# EAGLE design W108C (EAGLE 6.6.0)
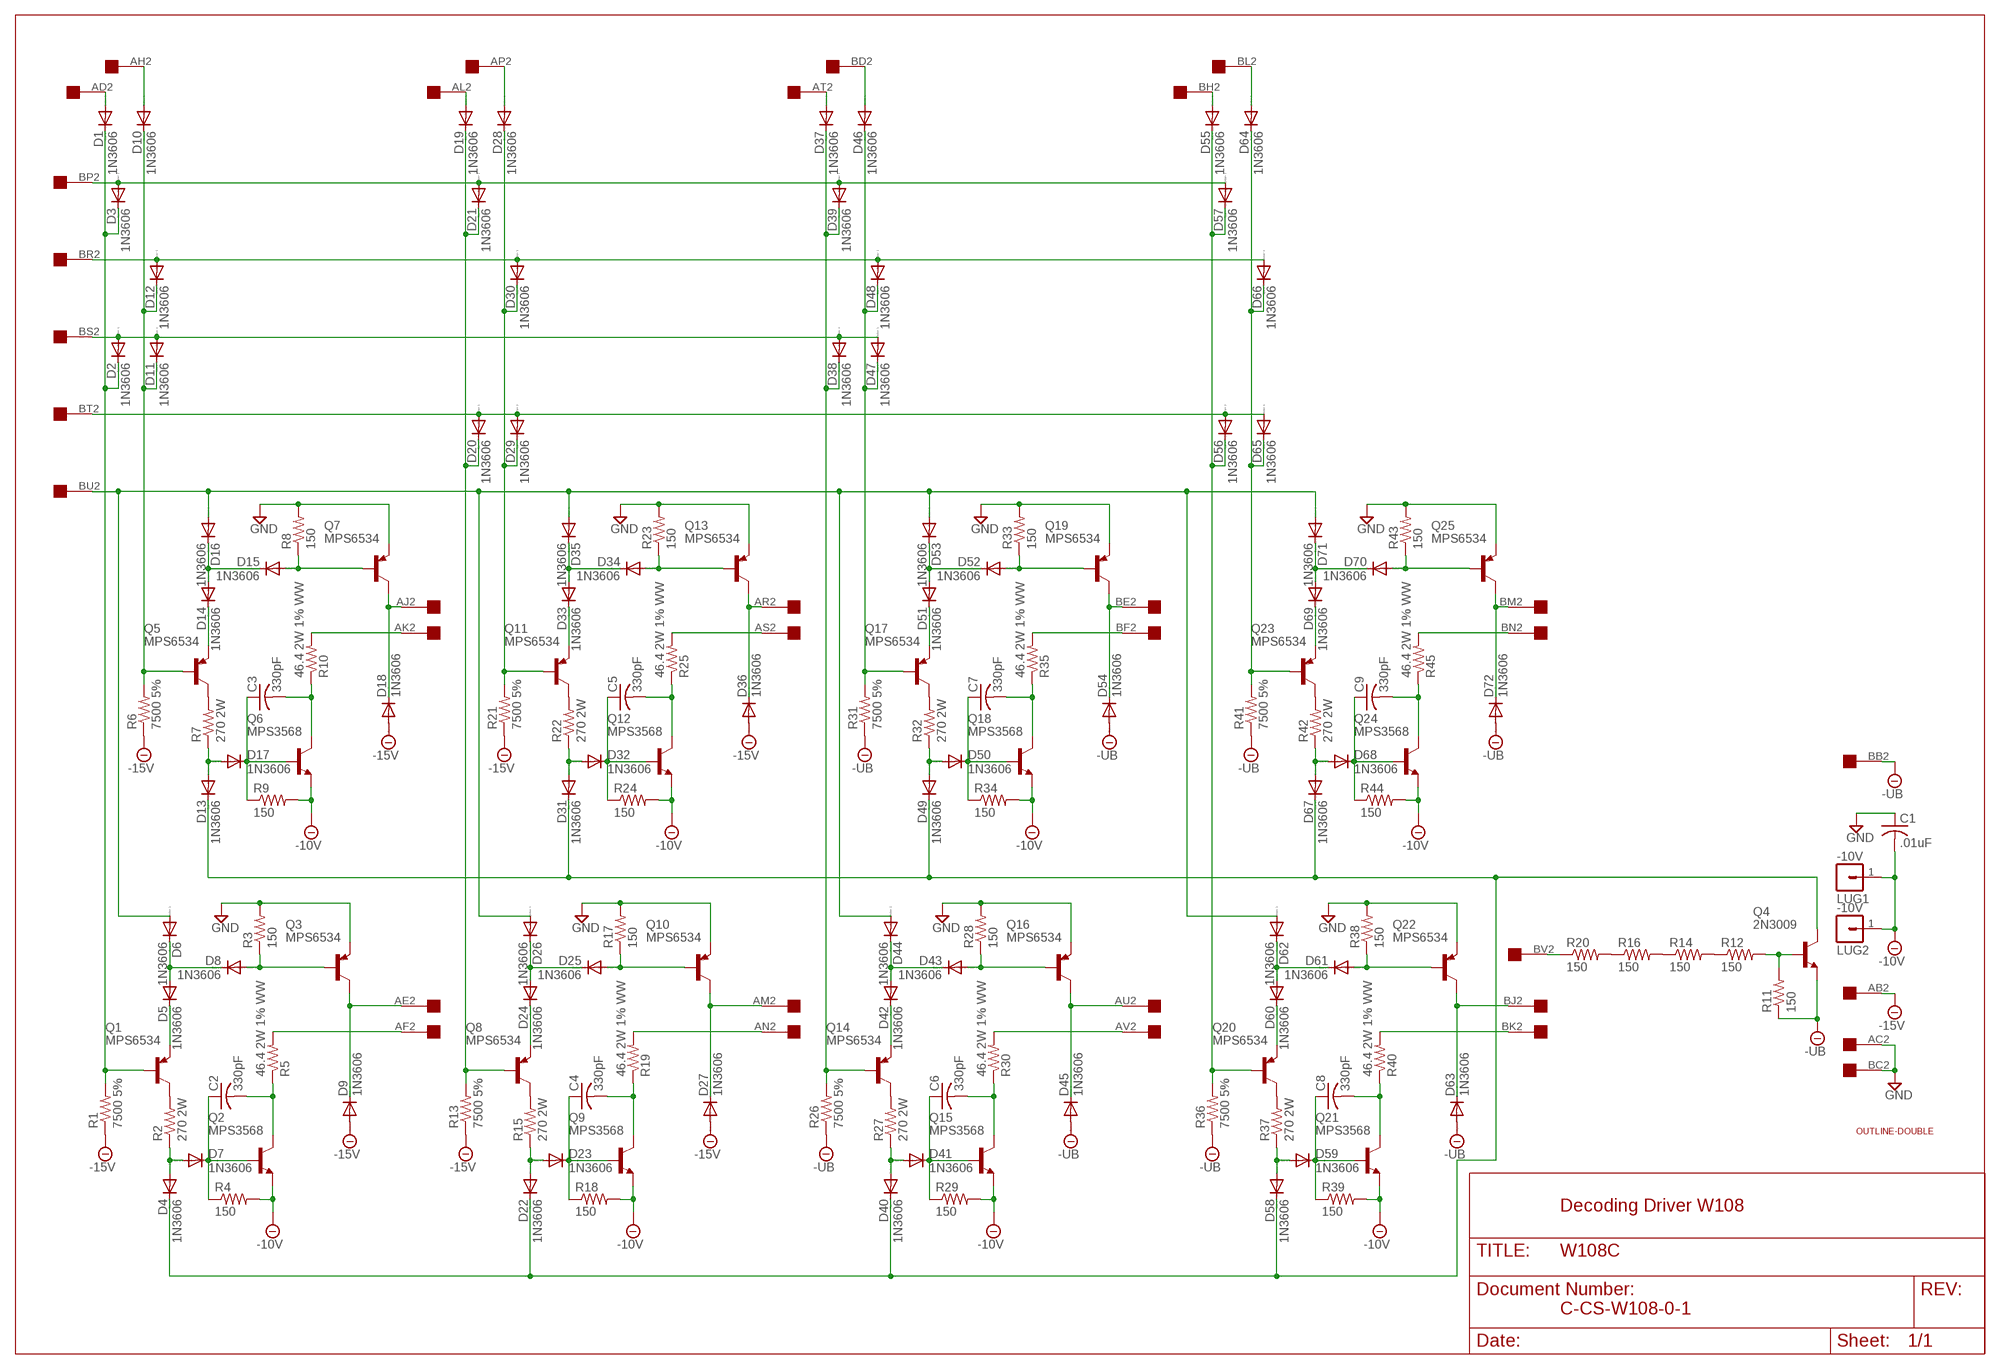
[diagram p0: schematic, sheet 1]

## Parts
C1  .01uF  C-US075-032X103  [C075-032X103]
C2  330pF  C-US075-032X103  [C075-032X103]
C3  330pF  C-US075-032X103  [C075-032X103]
C4  330pF  C-US075-032X103  [C075-032X103]
C5  330pF  C-US075-032X103  [C075-032X103]
C6  330pF  C-US075-032X103  [C075-032X103]
C7  330pF  C-US075-032X103  [C075-032X103]
C8  330pF  C-US075-032X103  [C075-032X103]
C9  330pF  C-US075-032X103  [C075-032X103]
D1  1N3606  1N4148DO35-10  [DO35-10]
D2  1N3606  1N4148DO35-10  [DO35-10]
D3  1N3606  1N4148DO35-10  [DO35-10]
D4  1N3606  1N4148DO35-10  [DO35-10]
D5  1N3606  1N4148DO35-10  [DO35-10]
D6  1N3606  1N4148DO35-10  [DO35-10]
D7  1N3606  1N4148DO35-10  [DO35-10]
D8  1N3606  1N4148DO35-10  [DO35-10]
D9  1N3606  1N4148DO35-10  [DO35-10]
D10  1N3606  1N4148DO35-10  [DO35-10]
D11  1N3606  1N4148DO35-10  [DO35-10]
D12  1N3606  1N4148DO35-10  [DO35-10]
D13  1N3606  1N4148DO35-10  [DO35-10]
D14  1N3606  1N4148DO35-10  [DO35-10]
D15  1N3606  1N4148DO35-10  [DO35-10]
D16  1N3606  1N4148DO35-10  [DO35-10]
D17  1N3606  1N4148DO35-10  [DO35-10]
D18  1N3606  1N4148DO35-10  [DO35-10]
D19  1N3606  1N4148DO35-10  [DO35-10]
D20  1N3606  1N4148DO35-10  [DO35-10]
D21  1N3606  1N4148DO35-10  [DO35-10]
D22  1N3606  1N4148DO35-10  [DO35-10]
D23  1N3606  1N4148DO35-10  [DO35-10]
D24  1N3606  1N4148DO35-10  [DO35-10]
D25  1N3606  1N4148DO35-10  [DO35-10]
D26  1N3606  1N4148DO35-10  [DO35-10]
D27  1N3606  1N4148DO35-10  [DO35-10]
D28  1N3606  1N4148DO35-10  [DO35-10]
D29  1N3606  1N4148DO35-10  [DO35-10]
D30  1N3606  1N4148DO35-10  [DO35-10]
D31  1N3606  1N4148DO35-10  [DO35-10]
D32  1N3606  1N4148DO35-10  [DO35-10]
D33  1N3606  1N4148DO35-10  [DO35-10]
D34  1N3606  1N4148DO35-10  [DO35-10]
D35  1N3606  1N4148DO35-10  [DO35-10]
D36  1N3606  1N4148DO35-10  [DO35-10]
D37  1N3606  1N4148DO35-10  [DO35-10]
D38  1N3606  1N4148DO35-10  [DO35-10]
D39  1N3606  1N4148DO35-10  [DO35-10]
D40  1N3606  1N4148DO35-10  [DO35-10]
D41  1N3606  1N4148DO35-10  [DO35-10]
D42  1N3606  1N4148DO35-10  [DO35-10]
D43  1N3606  1N4148DO35-10  [DO35-10]
D44  1N3606  1N4148DO35-10  [DO35-10]
D45  1N3606  1N4148DO35-10  [DO35-10]
D46  1N3606  1N4148DO35-10  [DO35-10]
D47  1N3606  1N4148DO35-10  [DO35-10]
D48  1N3606  1N4148DO35-10  [DO35-10]
D49  1N3606  1N4148DO35-10  [DO35-10]
D50  1N3606  1N4148DO35-10  [DO35-10]
D51  1N3606  1N4148DO35-10  [DO35-10]
D52  1N3606  1N4148DO35-10  [DO35-10]
D53  1N3606  1N4148DO35-10  [DO35-10]
D54  1N3606  1N4148DO35-10  [DO35-10]
D55  1N3606  1N4148DO35-10  [DO35-10]
D56  1N3606  1N4148DO35-10  [DO35-10]
D57  1N3606  1N4148DO35-10  [DO35-10]
D58  1N3606  1N4148DO35-10  [DO35-10]
D59  1N3606  1N4148DO35-10  [DO35-10]
D60  1N3606  1N4148DO35-10  [DO35-10]
D61  1N3606  1N4148DO35-10  [DO35-10]
D62  1N3606  1N4148DO35-10  [DO35-10]
D63  1N3606  1N4148DO35-10  [DO35-10]
D64  1N3606  1N4148DO35-10  [DO35-10]
D65  1N3606  1N4148DO35-10  [DO35-10]
D66  1N3606  1N4148DO35-10  [DO35-10]
D67  1N3606  1N4148DO35-10  [DO35-10]
D68  1N3606  1N4148DO35-10  [DO35-10]
D69  1N3606  1N4148DO35-10  [DO35-10]
D70  1N3606  1N4148DO35-10  [DO35-10]
D71  1N3606  1N4148DO35-10  [DO35-10]
D72  1N3606  1N4148DO35-10  [DO35-10]
LUG1  -10V  LUG  [SPADELUG]
LUG2  -10V  LUG  [SPADELUG]
Q1  MPS6534  2N2904  [TO39]
Q2  MPS3568  2N2102  [TO5]
Q3  MPS6534  2N2904  [TO39]
Q4  2N3009  2N2102  [TO5]
Q5  MPS6534  2N2904  [TO39]
Q6  MPS3568  2N2102  [TO5]
Q7  MPS6534  2N2904  [TO39]
Q8  MPS6534  2N2904  [TO39]
Q9  MPS3568  2N2102  [TO5]
Q10  MPS6534  2N2904  [TO39]
Q11  MPS6534  2N2904  [TO39]
Q12  MPS3568  2N2102  [TO5]
Q13  MPS6534  2N2904  [TO39]
Q14  MPS6534  2N2904  [TO39]
Q15  MPS3568  2N2102  [TO5]
Q16  MPS6534  2N2904  [TO39]
Q17  MPS6534  2N2904  [TO39]
Q18  MPS3568  2N2102  [TO5]
Q19  MPS6534  2N2904  [TO39]
Q20  MPS6534  2N2904  [TO39]
Q21  MPS3568  2N2102  [TO5]
Q22  MPS6534  2N2904  [TO39]
Q23  MPS6534  2N2904  [TO39]
Q24  MPS3568  2N2102  [TO5]
Q25  MPS6534  2N2904  [TO39]
R1  7500 5%  R-US_0207/10  [0207/10]
R2  270 2W  R-US_0617/22  [0617/22]
R3  150  R-US_0207/10  [0207/10]
R4  150  R-US_0207/10  [0207/10]
R5  46.4 2W 1% WW  R-US_0414/20  [0414/20]
R6  7500 5%  R-US_0207/10  [0207/10]
R7  270 2W  R-US_0617/22  [0617/22]
R8  150  R-US_0207/10  [0207/10]
R9  150  R-US_0207/10  [0207/10]
R10  46.4 2W 1% WW  R-US_0414/20  [0414/20]
R11  150  R-US_0207/10  [0207/10]
R12  150  R-US_0207/10  [0207/10]
R13  7500 5%  R-US_0207/10  [0207/10]
R14  150  R-US_0207/10  [0207/10]
R15  270 2W  R-US_0617/22  [0617/22]
R16  150  R-US_0207/10  [0207/10]
R17  150  R-US_0207/10  [0207/10]
R18  150  R-US_0207/10  [0207/10]
R19  46.4 2W 1% WW  R-US_0414/20  [0414/20]
R20  150  R-US_0207/10  [0207/10]
R21  7500 5%  R-US_0207/10  [0207/10]
R22  270 2W  R-US_0617/22  [0617/22]
R23  150  R-US_0207/10  [0207/10]
R24  150  R-US_0207/10  [0207/10]
R25  46.4 2W 1% WW  R-US_0414/20  [0414/20]
R26  7500 5%  R-US_0207/10  [0207/10]
R27  270 2W  R-US_0617/22  [0617/22]
R28  150  R-US_0207/10  [0207/10]
R29  150  R-US_0207/10  [0207/10]
R30  46.4 2W 1% WW  R-US_0414/20  [0414/20]
R31  7500 5%  R-US_0207/10  [0207/10]
R32  270 2W  R-US_0617/22  [0617/22]
R33  150  R-US_0207/10  [0207/10]
R34  150  R-US_0207/10  [0207/10]
R35  46.4 2W 1% WW  R-US_0414/20  [0414/20]
R36  7500 5%  R-US_0207/10  [0207/10]
R37  270 2W  R-US_0617/22  [0617/22]
R38  150  R-US_0207/10  [0207/10]
R39  150  R-US_0207/10  [0207/10]
R40  46.4 2W 1% WW  R-US_0414/20  [0414/20]
R41  7500 5%  R-US_0207/10  [0207/10]
R42  270 2W  R-US_0617/22  [0617/22]
R43  150  R-US_0207/10  [0207/10]
R44  150  R-US_0207/10  [0207/10]
R45  46.4 2W 1% WW  R-US_0414/20  [0414/20]
U$1  OUTLINE-DOUBLE  [DOUBLE]
U$2  DOUBLE  [EDGE-CON4]

## Nets
-10V [Supply]: C1.2 LUG1.1 LUG2.1 Q2.1(E) Q6.1(E) Q9.1(E) Q12.1(E) Q15.1(E) Q18.1(E) Q21.1(E) Q24.1(E) R4.2 R9.2 R18.2 R24.2 R29.2 R34.2 R39.2 R44.2
-15V [Supply]: D9.A D18.A D27.A D36.A R1.1 R6.1 R13.1 R21.1 U$2.AB2
-UB [Supply]: D45.A D54.A D63.A D72.A Q4.1(E) R11.1 R26.1 R31.1 R36.1 R41.1 U$2.BB2
GND [Supply]: C1.1 Q3.1(E) Q7.1(E) Q10.1(E) Q13.1(E) Q16.1(E) Q19.1(E) Q22.1(E) Q25.1(E) R3.2 R8.2 R17.2 R23.2 R28.2 R33.2 R38.2 R43.2 U$2.AC2 U$2.BC2
N$1: D1.C D2.C D3.C Q1.2(B) R1.2
N$2: Q1.3(C) R2.2
N$3: D4.A D7.A R2.1
N$4: C2.1 D7.C Q2.2(B) R4.1
N$5: R16.1 R20.2
N$6: C2.2 Q2.3(C) R5.1
N$7: R5.2 U$2.AF2
N$8: D4.C D13.C D22.C D31.C D40.C D49.C D58.C D67.C Q4.3(C)
N$9: D5.C Q1.1(E)
N$10: D5.A D6.C D8.C
N$11: D8.A Q3.2(B) R3.1
N$12: R14.1 R16.2
N$13: D9.C Q3.3(C) U$2.AE2
N$14: D1.A U$2.AD2
N$15: R12.1 R14.2
N$16: D6.A D16.A D26.A D35.A D44.A D53.A D62.A D71.A U$2.BU2
N$17: D20.A D29.A D56.A D65.A U$2.BT2
N$18: D2.A D11.A D38.A D47.A U$2.BS2
N$19: D3.A D21.A D39.A D57.A U$2.BP2
N$20: D12.A D30.A D48.A D66.A U$2.BR2
N$21: Q4.2(B) R11.2 R12.2
N$22: R20.1 U$2.BV2
N$23: D55.C D56.C D57.C Q20.2(B) R36.2
N$24: D10.C D11.C D12.C Q5.2(B) R6.2
N$25: Q20.3(C) R37.2
N$26: Q5.3(C) R7.2
N$27: D13.A D17.A R7.1
N$28: C3.1 D17.C Q6.2(B) R9.1
N$29: C3.2 Q6.3(C) R10.1
N$30: R10.2 U$2.AK2
N$31: D19.C D20.C D21.C Q8.2(B) R13.2
N$32: D14.C Q5.1(E)
N$33: D14.A D15.C D16.C
N$34: D15.A Q7.2(B) R8.1
N$35: D18.C Q7.3(C) U$2.AJ2
N$36: Q8.3(C) R15.2
N$37: D10.A U$2.AH2
N$38: D22.A D23.A R15.1
N$39: C4.1 D23.C Q9.2(B) R18.1
N$40: C4.2 Q9.3(C) R19.1
N$41: R19.2 U$2.AN2
N$42: D24.C Q8.1(E)
N$43: D24.A D25.C D26.C
N$44: D25.A Q10.2(B) R17.1
N$45: D27.C Q10.3(C) U$2.AM2
N$46: D28.C D29.C D30.C Q11.2(B) R21.2
N$47: Q11.3(C) R22.2
N$48: D31.A D32.A R22.1
N$49: C5.1 D32.C Q12.2(B) R24.1
N$50: C5.2 Q12.3(C) R25.1
N$51: R25.2 U$2.AS2
N$52: D33.C Q11.1(E)
N$53: D33.A D34.C D35.C
N$54: D34.A Q13.2(B) R23.1
N$55: D36.C Q13.3(C) U$2.AR2
N$56: D58.A D59.A R37.1
N$57: C8.1 D59.C Q21.2(B) R39.1
N$58: D37.C D38.C D39.C Q14.2(B) R26.2
N$59: Q14.3(C) R27.2
N$60: D40.A D41.A R27.1
N$61: C6.1 D41.C Q15.2(B) R29.1
N$62: C6.2 Q15.3(C) R30.1
N$63: R30.2 U$2.AV2
N$64: D42.C Q14.1(E)
N$65: D42.A D43.C D44.C
N$66: D43.A Q16.2(B) R28.1
N$67: D45.C Q16.3(C) U$2.AU2
N$68: D46.C D47.C D48.C Q17.2(B) R31.2
N$69: Q17.3(C) R32.2
N$70: D49.A D50.A R32.1
N$71: C7.1 D50.C Q18.2(B) R34.1
N$72: C7.2 Q18.3(C) R35.1
N$73: R35.2 U$2.BF2
N$74: D51.C Q17.1(E)
N$75: D51.A D52.C D53.C
N$76: D52.A Q19.2(B) R33.1
N$77: D54.C Q19.3(C) U$2.BE2
N$78: C8.2 Q21.3(C) R40.1
N$79: R40.2 U$2.BK2
N$80: D60.C Q20.1(E)
N$81: D60.A D61.C D62.C
N$82: D61.A Q22.2(B) R38.1
N$83: D63.C Q22.3(C) U$2.BJ2
N$84: D64.C D65.C D66.C Q23.2(B) R41.2
N$85: Q23.3(C) R42.2
N$86: D67.A D68.A R42.1
N$87: C9.1 D68.C Q24.2(B) R44.1
N$88: C9.2 Q24.3(C) R45.1
N$89: R45.2 U$2.BN2
N$90: D69.C Q23.1(E)
N$91: D69.A D70.C D71.C
N$92: D70.A Q25.2(B) R43.1
N$93: D72.C Q25.3(C) U$2.BM2
N$96: D19.A U$2.AL2
N$97: D28.A U$2.AP2
N$98: D37.A U$2.AT2
N$99: D46.A U$2.BD2
N$100: D55.A U$2.BH2
N$101: D64.A U$2.BL2
Unconnected: U$2.AA1 U$2.AA2 U$2.AB1 U$2.AC1 U$2.AD1 U$2.AE1 U$2.AF1 U$2.AH1 U$2.AJ1 U$2.AK1 U$2.AL1 U$2.AM1 U$2.AN1 U$2.AP1 U$2.AR1 U$2.AS1 U$2.AT1 U$2.AU1 U$2.AV1 U$2.BA1 U$2.BA2 U$2.BB1 U$2.BC1 U$2.BD1 U$2.BE1 U$2.BF1 U$2.BH1 U$2.BJ1 U$2.BK1 U$2.BL1 U$2.BM1 U$2.BN1 U$2.BP1 U$2.BR1 U$2.BS1 U$2.BT1 U$2.BU1 U$2.BV1

## Notes on the sheet
- Decoding Driver W108
- C-CS-W108-0-1

## Library data of the parts
C1-C9 = rcl:C-US: CAPACITOR, American symbol
D1-D72 = diode:1N4148: DIODE high speed (Philips)
LUG1 LUG2 = dec-con:LUG: Spade Lug
Q1 Q3 Q5 Q7 Q8 Q10 Q11 Q13 Q14 Q16 Q17 Q19 Q20 Q22 Q23 Q25 = transistor-pnp:2N2904*: PNP Transistror
Q2 Q4 Q6 Q9 Q12 Q15 Q18 Q21 Q24 = transistor-npn:2N2102: NPN Transistor
R1-R4 R6-R9 R11-R18 R20-R24 R26-R29 R31-R34 R36-R39 R41-R44 = rcl:R-US_: RESISTOR, American symbol
R5 R10 R19 R25 R30 R35 R40 R45 = dec-con:R-US_0414/20: 0.8" Resistor
U$1 = dec-con:OUTLINE-*: Board outlines for DEC boards.
U$2 = dec-con:DOUBLE: Double-Height DEC board

## Net classes
1 Supply: width 0.813 mm

## Board
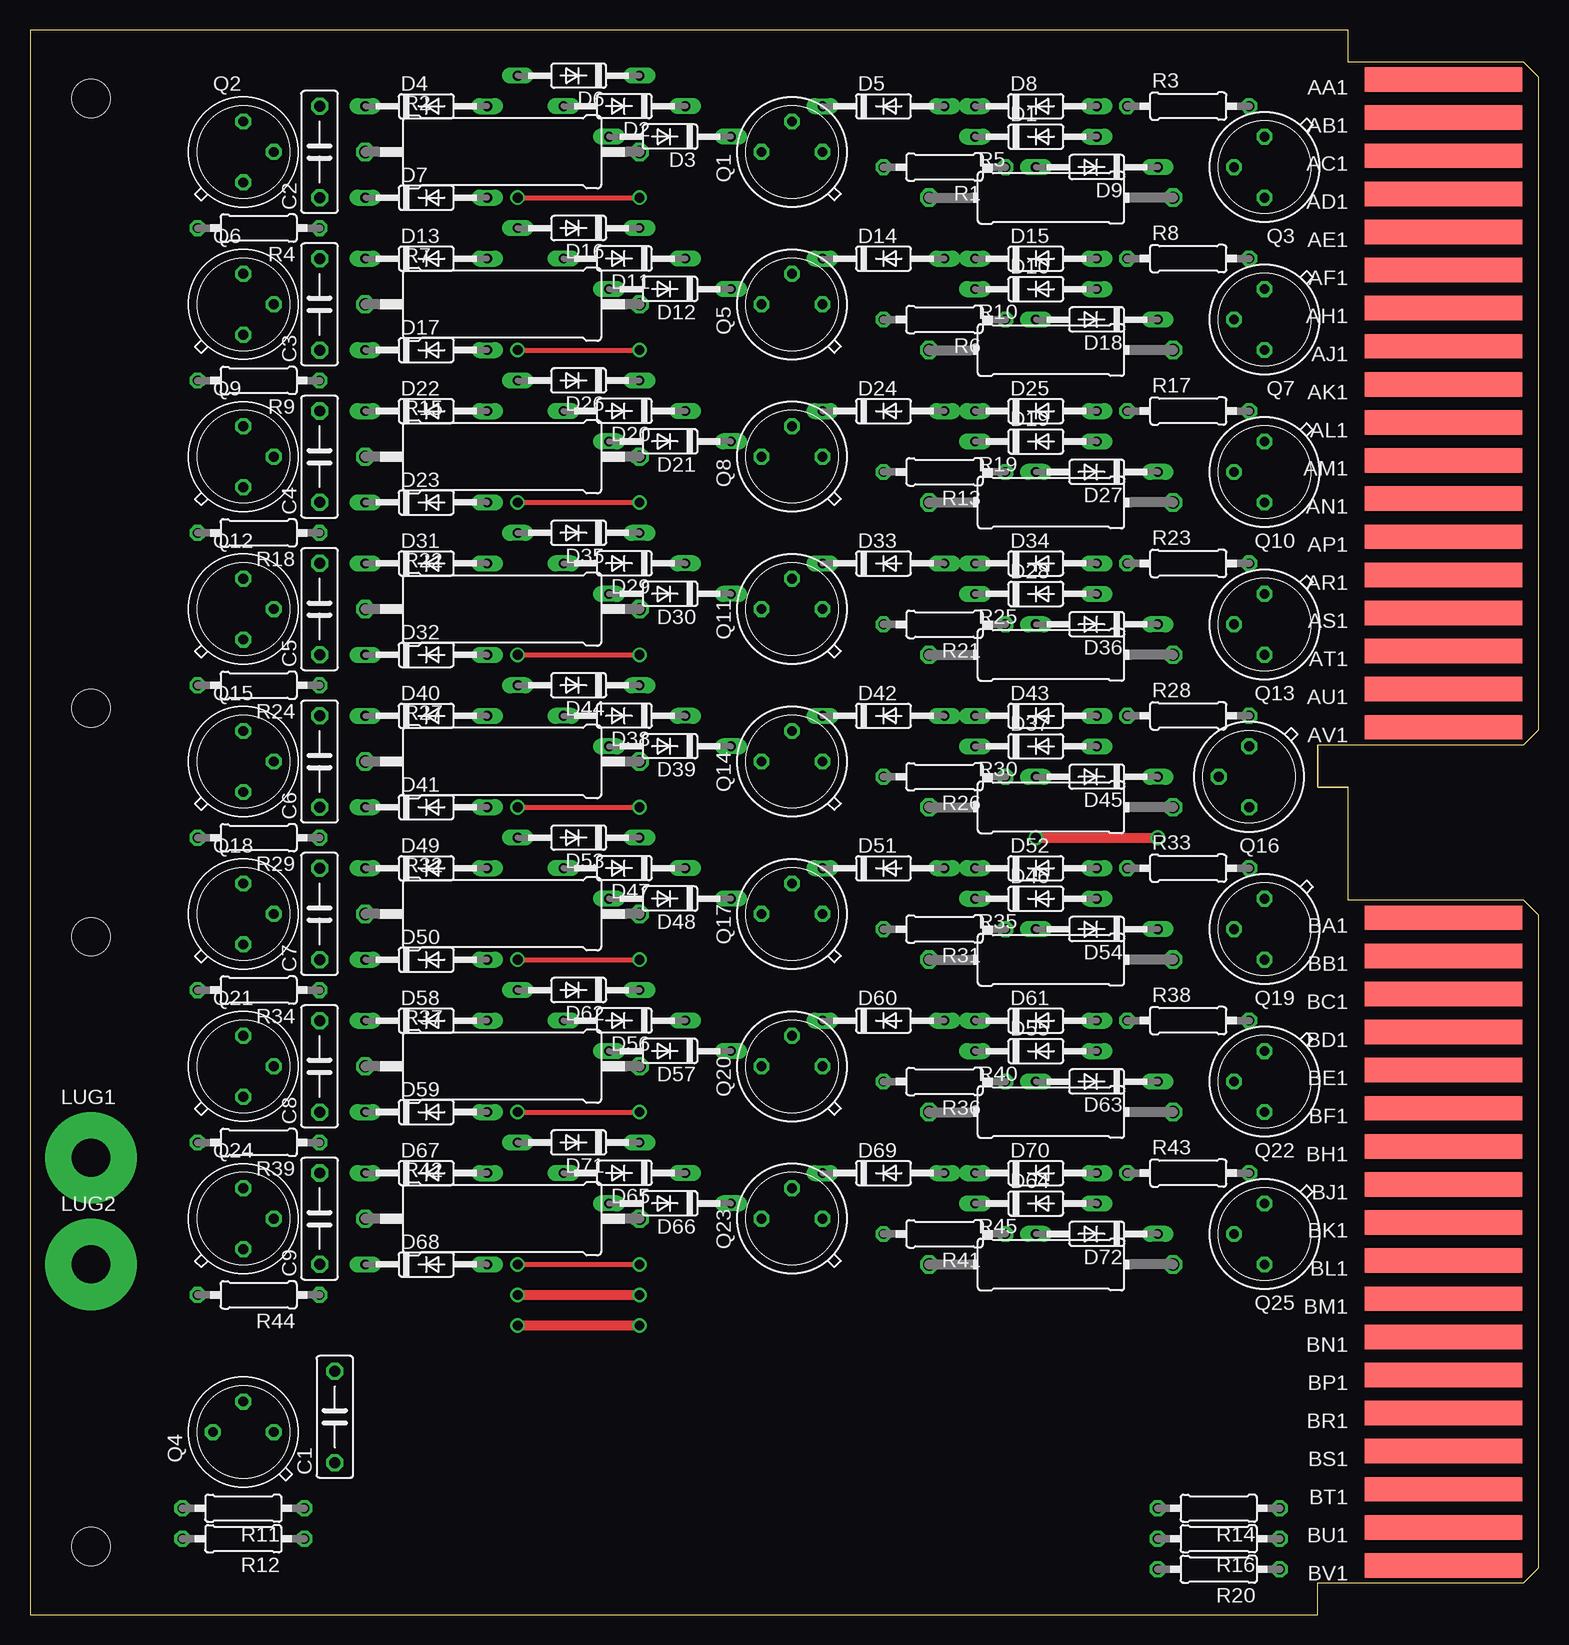
[diagram p1: board, top side]
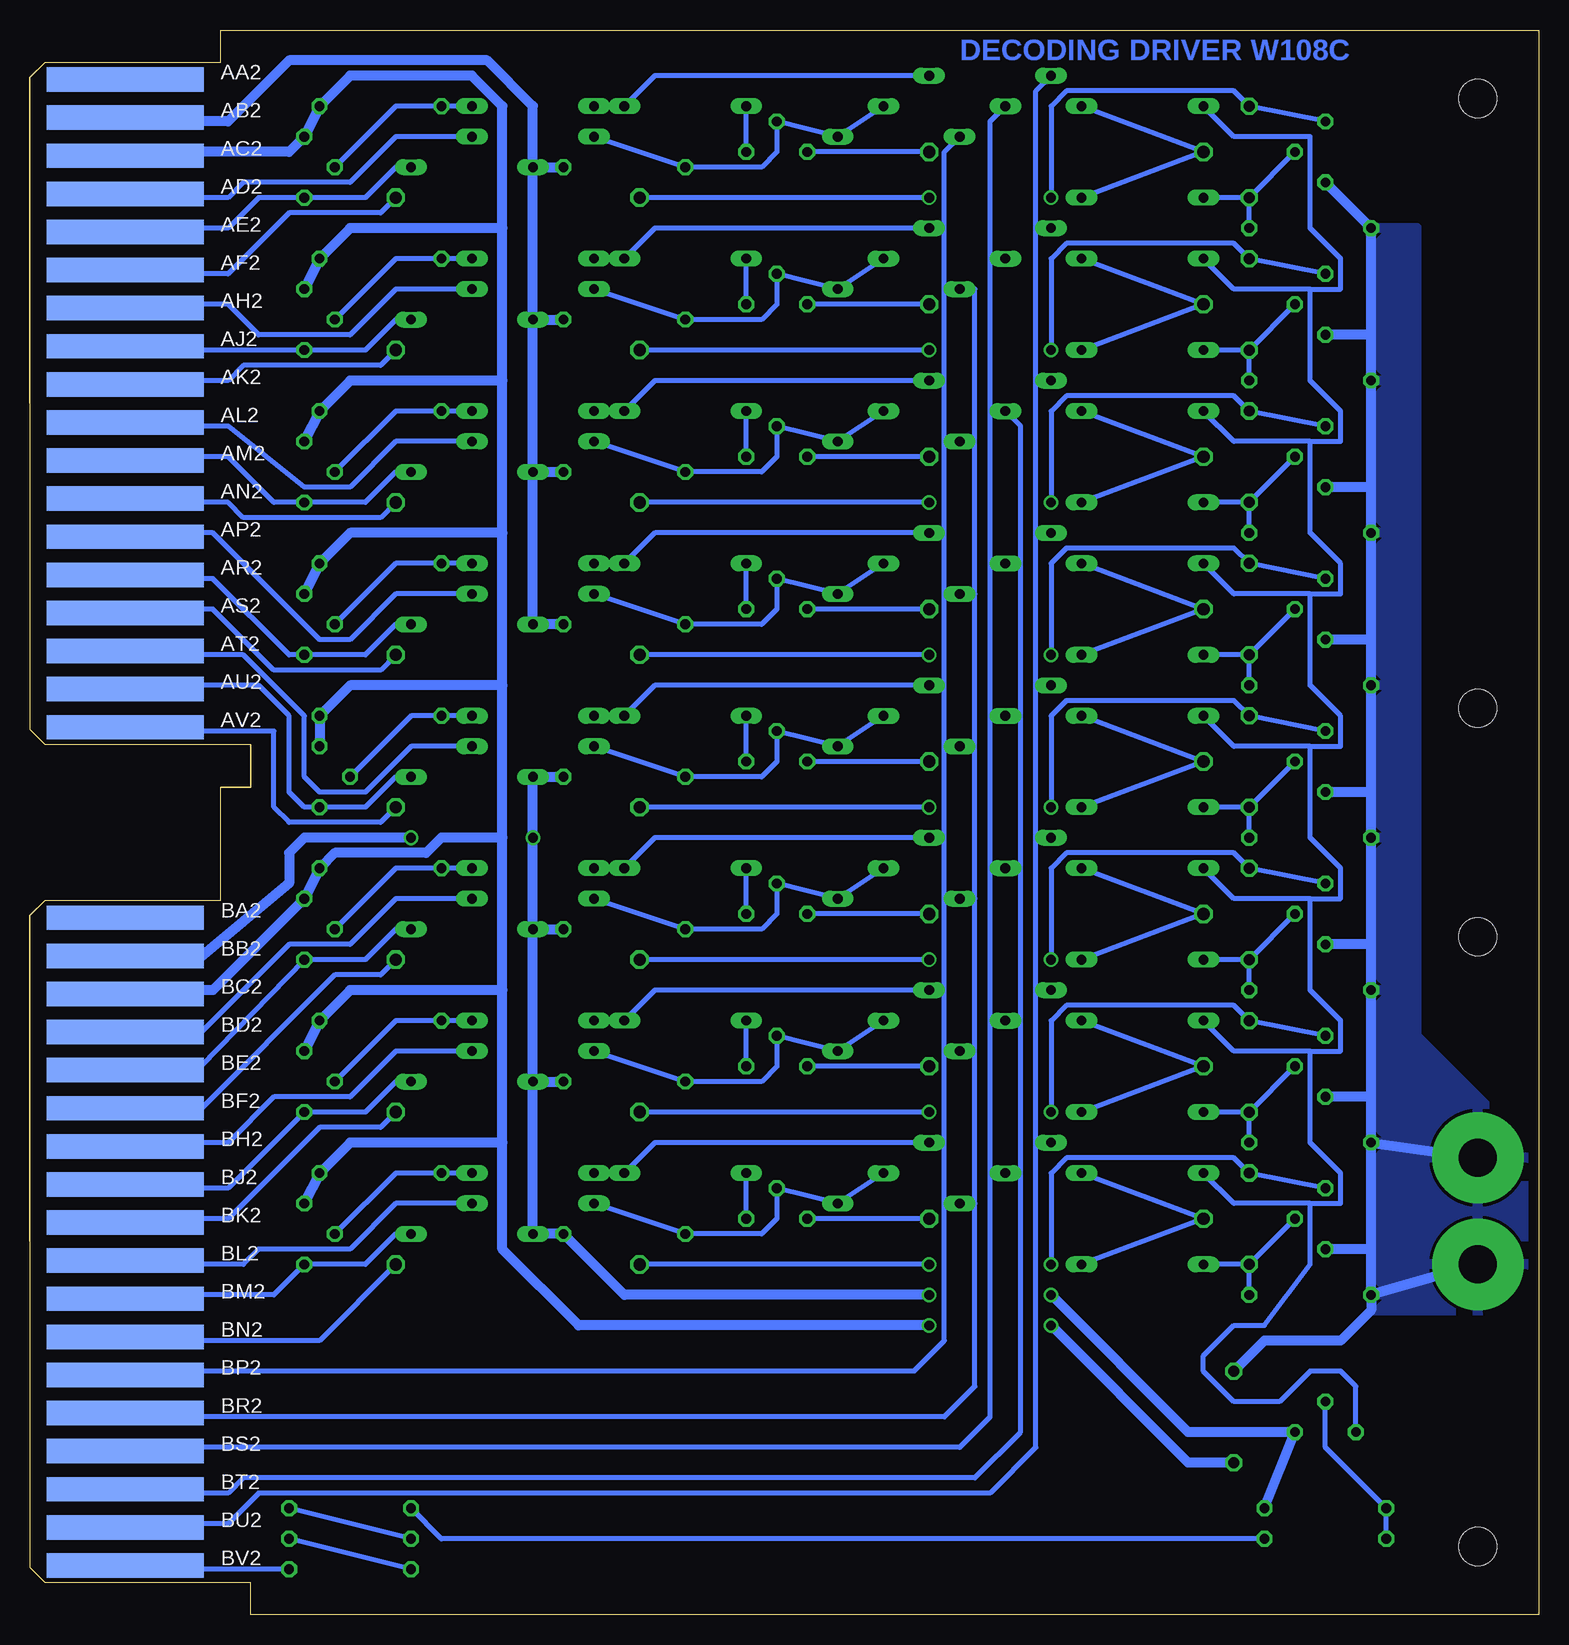
[diagram p2: board, bottom side, seen from below]

Size 125.73 x 132.08 mm. Coordinates in mm from the lower left corner, seen from the top.
Copper layers (1+16): Top 0.035mm / dielectric 1.5mm / Bottom 0.035mm
Design rules "16mils": minimum track width 16mil, minimum drill 32mil, track to track 15mil, track to pad 10mil, pad to pad 10mil, via to via 10mil, smd to smd 10mil, copper to edge 13mil, drill to drill 10mil, minimum pad ring 10mil, minimum via ring 8mil, stop-mask expansion 0mil, vias tented up to drill 0mil, thermal gap 10mil
vRestrict: area 31.8,108 to 41.9,125.7; area 49.5,108 to 59.7,125.7; area 67.3,108 to 77.5,125.7; area 85.1,108 to 95.2,125.7; area 102.9,108 to 113,125.7; area 31.8,80 to 41.9,97.8; area 49.5,80 to 59.7,97.8; area 67.3,80 to 77.5,97.8; area 85.1,80 to 95.2,97.8; area 31.8,34.3 to 41.9,52.1; area 49.5,34.3 to 59.7,52.1; area 67.3,34.3 to 77.5,52.1; area 85.1,34.3 to 95.2,52.1; area 102.9,11.4 to 113,29.2; area 85.1,11.4 to 95.2,29.2; area 49.5,11.4 to 59.7,29.2; area 31.8,11.4 to 41.9,29.2; area 67.3,11.4 to 77.5,29.2

### Footprints (pad centres in the part's own frame; a part is rotated, then mirrored left to right if it is on the bottom)
C075-032X103 = drill 0.914 octagon: 1 -3.81,0; 2 3.81,0
DO35-10 = drill 0.813 long: A 5.08,0; C -5.08,0
SPADELUG = drill 3.175 pad 7.62: 1 0,0
TO39 = drill 0.813 octagon: 1 0,-2.54; 2 2.54,0; 3 0,2.54
TO5 = drill 0.813 octagon: 1 0,-2.54; 2 2.54,0; 3 0,2.54
0207/10 = drill 0.813 octagon: 1 -5.08,0; 2 5.08,0
0617/22 = drill 1.016 octagon: 1 -11.43,0; 2 11.43,0
0414/20 = drill 1.016 octagon: 1 -10.16,0; 2 10.16,0
DOUBLE = hole 3.175: 120.65,56.515; 120.65,5.715; 120.65,75.565; 120.65,126.365
EDGE-CON4 = smd 13.106 x 2.032: AA1 7.938,4.128; AB1 7.938,7.303; AC1 7.938,10.477; AD1 7.938,13.652; AE1 7.938,16.828; AF1 7.938,20.003; AH1 7.938,23.177; AJ1 7.938,26.352; AK1 7.938,29.527; AL1 7.938,32.703; AM1 7.938,35.877; AN1 7.938,39.053; AP1 7.938,42.227; AR1 7.938,45.403; AS1 7.938,48.578; AT1 7.938,51.752; AU1 7.938,54.928; AV1 7.938,58.102; BA1 7.938,73.978; BB1 7.938,77.153; BC1 7.938,80.328; BD1 7.938,83.502; BE1 7.938,86.677; BF1 7.938,89.853; BH1 7.938,93.028; BJ1 7.938,96.203; BK1 7.938,99.377; BL1 7.938,102.552; BM1 7.938,105.728; BN1 7.938,108.903; BP1 7.938,112.078; BR1 7.938,115.252; BS1 7.938,118.427; BT1 7.938,121.603; BU1 7.938,124.778; BV1 7.938,127.953 | smd 13.106 x 2.032 bottom: AA2 7.938,4.128; AB2 7.938,7.303; AC2 7.938,10.477; AD2 7.938,13.652; AE2 7.938,16.828; AF2 7.938,20.003; AH2 7.938,23.177; AJ2 7.938,26.352; AK2 7.938,29.527; AL2 7.938,32.703; AM2 7.938,35.877; AN2 7.938,39.053; AP2 7.938,42.227; AR2 7.938,45.403; AS2 7.938,48.578; AT2 7.938,51.752; AU2 7.938,54.928; AV2 7.938,58.102; BA2 7.938,73.978; BB2 7.938,77.153; BC2 7.938,80.328; BD2 7.938,83.502; BE2 7.938,86.677; BF2 7.938,89.853; BH2 7.938,93.028; BJ2 7.938,96.203; BK2 7.938,99.377; BL2 7.938,102.552; BM2 7.938,105.728; BN2 7.938,108.903; BP2 7.938,112.078; BR2 7.938,115.252; BS2 7.938,118.427; BT2 7.938,121.603; BU2 7.938,124.778; BV2 7.938,127.953

### Placement (x,y rotation side)
C1  25.4,16.51 90 top
C2  24.13,121.92 90 top
C3  24.13,109.22 90 top
C4  24.13,96.52 90 top
C5  24.13,83.82 90 top
C6  24.13,71.12 90 top
C7  24.13,58.42 90 top
C8  24.13,45.72 90 top
C9  24.13,33.02 90 top
D1  83.82,123.19 0 top
D2  49.53,125.73 180 top
D3  53.34,123.19 180 top
D4  33.02,125.73 0 top
D5  71.12,125.73 0 top
D6  45.72,128.27 180 top
D7  33.02,118.11 0 top
D8  83.82,125.73 0 top
D9  88.9,120.65 180 top
D10  83.82,110.49 0 top
D11  49.53,113.03 180 top
D12  53.34,110.49 180 top
D13  33.02,113.03 0 top
D14  71.12,113.03 0 top
D15  83.82,113.03 0 top
D16  45.72,115.57 180 top
D17  33.02,105.41 0 top
D18  88.9,107.95 180 top
D19  83.82,97.79 0 top
D20  49.53,100.33 180 top
D21  53.34,97.79 180 top
D22  33.02,100.33 0 top
D23  33.02,92.71 0 top
D24  71.12,100.33 0 top
D25  83.82,100.33 0 top
D26  45.72,102.87 180 top
D27  88.9,95.25 180 top
D28  83.82,85.09 0 top
D29  49.53,87.63 180 top
D30  53.34,85.09 180 top
D31  33.02,87.63 0 top
D32  33.02,80.01 0 top
D33  71.12,87.63 0 top
D34  83.82,87.63 0 top
D35  45.72,90.17 180 top
D36  88.9,82.55 180 top
D37  83.82,72.39 0 top
D38  49.53,74.93 180 top
D39  53.34,72.39 180 top
D40  33.02,74.93 0 top
D41  33.02,67.31 0 top
D42  71.12,74.93 0 top
D43  83.82,74.93 0 top
D44  45.72,77.47 180 top
D45  88.9,69.85 180 top
D46  83.82,59.69 0 top
D47  49.53,62.23 180 top
D48  53.34,59.69 180 top
D49  33.02,62.23 0 top
D50  33.02,54.61 0 top
D51  71.12,62.23 0 top
D52  83.82,62.23 0 top
D53  45.72,64.77 180 top
D54  88.9,57.15 180 top
D55  83.82,46.99 0 top
D56  49.53,49.53 180 top
D57  53.34,46.99 180 top
D58  33.02,49.53 0 top
D59  33.02,41.91 0 top
D60  71.12,49.53 0 top
D61  83.82,49.53 0 top
D62  45.72,52.07 180 top
D63  88.9,44.45 180 top
D64  83.82,34.29 0 top
D65  49.53,36.83 180 top
D66  53.34,34.29 180 top
D67  33.02,36.83 0 top
D68  33.02,29.21 0 top
D69  71.12,36.83 0 top
D70  83.82,36.83 0 top
D71  45.72,39.37 180 top
D72  88.9,31.75 180 top
LUG1  5.08,38.1 0 top
LUG2  5.08,29.21 0 top
Q1  63.5,121.92 90 top
Q2  17.78,121.92 0 top
Q3  102.87,120.65 180 top
Q4  17.78,15.24 90 top
Q5  63.5,109.22 90 top
Q6  17.78,109.22 0 top
Q7  102.87,107.95 180 top
Q8  63.5,96.52 90 top
Q9  17.78,96.52 0 top
Q10  102.87,95.25 180 top
Q11  63.5,83.82 90 top
Q12  17.78,83.82 0 top
Q13  102.87,82.55 180 top
Q14  63.5,71.12 90 top
Q15  17.78,71.12 0 top
Q16  101.6,69.85 180 top
Q17  63.5,58.42 90 top
Q18  17.78,58.42 0 top
Q19  102.87,57.15 180 top
Q20  63.5,45.72 90 top
Q21  17.78,45.72 0 top
Q22  102.87,44.45 180 top
Q23  63.5,33.02 90 top
Q24  17.78,33.02 0 top
Q25  102.87,31.75 180 top
R1  76.2,120.65 180 top
R2  39.37,121.92 0 top
R3  96.52,125.73 0 top
R4  19.05,115.57 180 top
R5  85.09,118.11 0 top
R6  76.2,107.95 180 top
R7  39.37,109.22 0 top
R8  96.52,113.03 0 top
R9  19.05,102.87 180 top
R10  85.09,105.41 0 top
R11  17.78,8.89 180 top
R12  17.78,6.35 180 top
R13  76.2,95.25 180 top
R14  99.06,8.89 180 top
R15  39.37,96.52 0 top
R16  99.06,6.35 180 top
R17  96.52,100.33 0 top
R18  19.05,90.17 180 top
R19  85.09,92.71 0 top
R20  99.06,3.81 180 top
R21  76.2,82.55 180 top
R22  39.37,83.82 0 top
R23  96.52,87.63 0 top
R24  19.05,77.47 180 top
R25  85.09,80.01 0 top
R26  76.2,69.85 180 top
R27  39.37,71.12 0 top
R28  96.52,74.93 0 top
R29  19.05,64.77 180 top
R30  85.09,67.31 0 top
R31  76.2,57.15 180 top
R32  39.37,58.42 0 top
R33  96.52,62.23 0 top
R34  19.05,52.07 180 top
R35  85.09,54.61 0 top
R36  76.2,44.45 180 top
R37  39.37,45.72 0 top
R38  96.52,49.53 0 top
R39  19.05,39.37 180 top
R40  85.09,41.91 0 top
R41  76.2,31.75 180 top
R42  39.37,33.02 0 top
R43  96.52,36.83 0 top
R44  19.05,26.67 180 top
R45  85.09,29.21 0 top
U$1  125.73,132.08 180 top
U$2  125.73,132.08 180 top

### Tracks (layer width: path | path; a pad name or v marks a point on that pad's centre or on a via)
-10V
  Bottom 0.813: LUG2.1 R44.2 | 13.97,30.48 R39.2 | R39.2 13.97,43.18 | 13.97,43.18 Q21.1 | 13.97,43.18 R34.2 13.97,55.88 | 13.97,55.88 Q18.1 | 13.97,55.88 R29.2 13.97,68.58 | 13.97,81.28 R24.2 13.97,68.58 | 13.97,68.58 Q15.1 | 13.97,81.28 Q12.1 | 13.97,81.28 R18.2 13.97,93.98 | 13.97,93.98 R9.2 13.97,106.68 | 13.97,93.98 Q9.1 | 13.97,106.68 Q6.1 | 13.97,106.68 R4.2 Q2.1 | R39.2 LUG1.1 | 13.97,30.48 Q24.1 | R44.2 13.97,30.48 | R44.2 13.97,25.4 16.51,22.86 17.78,22.86 22.86,22.86 C1.2
  pour Bottom: 1.27,27.94 1.27,39.37 10.16,48.26 10.16,115.57 13.97,115.57 13.97,25.4 3.81,25.4
-15V
  Bottom 0.813: U$2.AB2 116.84,124.46 109.22,124.46 104.14,129.54 87.63,129.54 83.82,125.73 D9.A | D9.A R1.1 | D18.A D9.A | D18.A R6.1 | D27.A R13.1 | D27.A D18.A | D27.A D36.A R21.1
-UB  (via drill 0.81)
  Top 0.813: v83.82,64.77 v93.98,64.77 | v40.64,26.67 v50.8,26.67
  Bottom 0.813: R26.1 D45.A v83.82,64.77 D54.A | D54.A R31.1 | D63.A R36.1 | D63.A D54.A | D63.A D72.A R41.1 76.2,26.67 v50.8,26.67 | U$2.BB2 116.84,54.61 111.76,54.61 104.14,60.96 104.14,63.5 102.87,64.77 v93.98,64.77 | Q4.1 R11.1 Q4.1 | Q4.1 29.21,15.24 v40.64,26.67
GND  (via drill 0.81)
  Top 0.813: v40.64,24.13 v50.8,24.13
  Bottom 0.813: U$2.AC2 116.84,121.92 104.14,121.92 Q3.1 R3.2 99.06,128.27 88.9,128.27 86.36,125.73 86.36,115.57 | Q7.1 R8.2 99.06,115.57 86.36,115.57 | Q10.1 R17.2 99.06,102.87 86.36,102.87 | Q13.1 R23.2 99.06,90.17 86.36,90.17 | Q16.1 R28.2 99.06,77.47 86.36,77.47 | Q22.1 R38.2 99.06,52.07 86.36,52.07 | Q25.1 R43.2 99.06,39.37 86.36,39.37 | 86.36,39.37 86.36,52.07 | 86.36,52.07 86.36,64.77 | 86.36,64.77 86.36,77.47 | 86.36,77.47 86.36,90.17 | 86.36,90.17 86.36,102.87 | 86.36,102.87 86.36,115.57 | 86.36,64.77 91.44,64.77 92.71,63.5 100.33,63.5 R33.2 Q19.1 110.49,52.07 116.84,52.07 U$2.BC2 | C1.1 29.21,12.7 v40.64,24.13 | v50.8,24.13 80.01,24.13 86.36,30.48 86.36,39.37
N$1
  Bottom 0.406: D1.C R1.2 64.77,120.65 63.5,121.92 Q1.2 D3.C D2.C
N$2
  Bottom 0.406: R2.2 Q1.3
N$3
  Bottom 0.406: D4.A R2.1 D7.A
N$4
  Bottom 0.406: C2.1 Q2.2 | C2.1 D7.C | R4.1 C2.1
N$5
  Bottom 0.406: R20.2 R16.1
N$6  (via drill 0.81)
  Top 0.406: v40.64,118.11 v50.8,118.11
  Bottom 0.406: v50.8,118.11 R5.1 | Q2.3 C2.2 25.4,127 39.37,127 40.64,125.73 v40.64,118.11
N$7
  Bottom 0.406: R5.2 96.52,116.84 104.14,116.84 109.22,111.76 116.84,111.76 U$2.AF2
N$8
  Bottom 0.406: D4.C 25.4,123.19 19.05,123.19 19.05,115.57 16.51,113.03 16.51,110.49 19.05,110.49 | 19.05,110.49 19.05,102.87 16.51,100.33 16.51,97.79 19.05,97.79 | 19.05,110.49 25.4,110.49 D13.C | 19.05,97.79 25.4,97.79 D22.C | 19.05,97.79 19.05,90.17 16.51,87.63 16.51,85.09 19.05,85.09 | D31.C 25.4,85.09 19.05,85.09 | 19.05,85.09 19.05,77.47 16.51,74.93 16.51,72.39 19.05,72.39 | 19.05,72.39 25.4,72.39 D40.C | D67.C 25.4,34.29 19.05,34.29 | 19.05,34.29 16.51,34.29 16.51,36.83 19.05,39.37 19.05,46.99 | 19.05,46.99 16.51,46.99 16.51,49.53 19.05,52.07 19.05,59.69 | 19.05,59.69 16.51,59.69 16.51,62.23 19.05,64.77 19.05,72.39 | D49.C 25.4,59.69 19.05,59.69 | D58.C 25.4,46.99 19.05,46.99 | Q4.3 15.24,19.05 16.51,20.32 19.05,20.32 21.59,17.78 25.4,17.78 27.94,20.32 27.94,21.59 25.4,24.13 22.86,24.13 19.05,29.21 19.05,34.29
N$9
  Bottom 0.406: Q1.1 D5.C
N$10
  Bottom 0.406: D8.C D5.A 73.66,128.27 D6.C
N$11
  Bottom 0.406: Q3.2 95.25,125.73 R3.1 D8.A
N$12
  Bottom 0.406: R16.2 R14.1
N$13
  Bottom 0.406: D9.C 95.25,120.65 97.79,118.11 Q3.3 106.68,118.11 109.22,115.57 116.84,115.57 U$2.AE2
N$14
  Bottom 0.406: D1.A 95.25,123.19 99.06,119.38 107.95,119.38 109.22,118.11 116.84,118.11 U$2.AD2
N$15
  Bottom 0.406: R14.2 91.44,6.35 R12.1
N$16
  Bottom 0.406: D6.A 41.91,127 41.91,115.57 | 41.91,39.37 41.91,13.97 45.72,10.16 106.68,10.16 109.22,7.62 116.84,7.62 U$2.BU2 | 41.91,39.37 41.91,52.07 | 41.91,52.07 41.91,64.77 | 41.91,64.77 41.91,77.47 | 41.91,77.47 41.91,90.17 | 41.91,90.17 41.91,102.87 | 41.91,102.87 41.91,115.57 | 41.91,115.57 D16.A | 41.91,102.87 D26.A | 41.91,90.17 D35.A | 41.91,77.47 D44.A | 41.91,39.37 D71.A | 41.91,52.07 D62.A | 41.91,64.77 D53.A
N$17
  Bottom 0.406: D20.A 43.18,99.06 43.18,87.63 | 43.18,87.63 D29.A | 43.18,36.83 43.18,15.24 46.99,11.43 107.95,11.43 109.22,10.16 116.84,10.16 U$2.BT2 | 43.18,36.83 43.18,49.53 | 43.18,49.53 43.18,87.63 | 43.18,36.83 D65.A | 43.18,49.53 D56.A
N$18
  Bottom 0.406: 45.72,113.03 45.72,124.46 D2.A | 45.72,62.23 45.72,16.51 48.26,13.97 116.84,13.97 U$2.BS2 | 45.72,62.23 45.72,74.93 | 45.72,74.93 45.72,113.03 | 45.72,113.03 D11.A | 45.72,74.93 D38.A | 45.72,62.23 D47.A
N$19
  Bottom 0.406: D3.A 49.53,121.92 49.53,97.79 | 49.53,46.99 49.53,22.86 52.07,20.32 116.84,20.32 U$2.BP2 | 49.53,46.99 49.53,72.39 | 49.53,72.39 49.53,97.79 | 49.53,97.79 D21.A | 49.53,46.99 D57.A | 49.53,72.39 D39.A
N$20
  Bottom 0.406: D12.A 46.99,110.49 46.99,85.09 | 46.99,34.29 46.99,19.05 49.53,16.51 116.84,16.51 U$2.BR2 | 46.99,34.29 46.99,59.69 | 46.99,59.69 46.99,85.09 | 46.99,34.29 D66.A | 46.99,85.09 D30.A | 46.99,59.69 D48.A
N$21
  Bottom 0.406: R12.2 R11.2 17.78,13.97 Q4.2
N$22
  Bottom 0.406: U$2.BV2 116.84,3.81 R20.1
N$23
  Bottom 0.406: D55.C R36.2 64.77,44.45 63.5,45.72 Q20.2 D57.C D56.C
N$24
  Bottom 0.406: D11.C D12.C Q5.2 63.5,109.22 64.77,107.95 R6.2 D10.C
N$25
  Bottom 0.406: R37.2 Q20.3
N$26
  Bottom 0.406: R7.2 Q5.3
N$27
  Bottom 0.406: D17.A R7.1 D13.A
N$28
  Bottom 0.406: C3.1 Q6.2 | R9.1 C3.1 | C3.1 D17.C
N$29  (via drill 0.81)
  Top 0.406: v40.64,105.41 v50.8,105.41
  Bottom 0.406: Q6.3 C3.2 25.4,114.3 39.37,114.3 40.64,113.03 v40.64,105.41 | v50.8,105.41 R10.1
N$30
  Bottom 0.406: U$2.AK2 116.84,102.87 109.22,102.87 107.95,104.14 96.52,104.14 R10.2
N$31
  Bottom 0.406: D20.C D21.C Q8.2 63.5,96.52 64.77,95.25 R13.2 D19.C
N$32
  Bottom 0.406: Q5.1 D14.C
N$33
  Bottom 0.406: D15.C D14.A 73.66,115.57 D16.C
N$34
  Bottom 0.406: D15.A R8.1 95.25,113.03 Q7.2
N$35
  Bottom 0.406: D18.C 95.25,107.95 97.79,105.41 Q7.3 116.84,105.41 U$2.AJ2
N$36
  Bottom 0.406: R15.2 Q8.3
N$37
  Bottom 0.406: U$2.AH2 116.84,109.22 109.22,109.22 106.68,106.68 99.06,106.68 95.25,110.49 D10.A
N$38
  Bottom 0.406: D23.A R15.1 D22.A
N$39
  Bottom 0.406: R18.1 C4.1 | C4.1 Q9.2 | C4.1 D23.C
N$40  (via drill 0.81)
  Top 0.406: v40.64,92.71 v50.8,92.71
  Bottom 0.406: Q9.3 C4.2 25.4,101.6 39.37,101.6 40.64,100.33 v40.64,92.71 | v50.8,92.71 R19.1
N$41
  Bottom 0.406: R19.2 96.52,91.44 107.95,91.44 109.22,92.71 116.84,92.71 U$2.AN2
N$42
  Bottom 0.406: Q8.1 D24.C
N$43
  Bottom 0.406: D26.C 73.66,102.87 D24.A D25.C
N$44
  Bottom 0.406: D25.A R17.1 95.25,100.33 Q10.2
N$45
  Bottom 0.406: D27.C 95.25,95.25 97.79,92.71 Q10.3 105.41,92.71 109.22,96.52 116.84,96.52 U$2.AM2
N$46
  Bottom 0.406: D29.C D30.C Q11.2 63.5,83.82 64.77,82.55 R21.2 D28.C
N$47
  Bottom 0.406: R22.2 Q11.3
N$48
  Bottom 0.406: D32.A R22.1 D31.A
N$49
  Bottom 0.406: R24.1 C5.1 | C5.1 D32.C | C5.1 Q12.2
N$50  (via drill 0.81)
  Top 0.406: v40.64,80.01 v50.8,80.01
  Bottom 0.406: Q12.3 C5.2 25.4,88.9 39.37,88.9 40.64,87.63 v40.64,80.01 | v50.8,80.01 R25.1
N$51
  Bottom 0.406: U$2.AS2 116.84,83.82 110.49,83.82 105.41,78.74 96.52,78.74 R25.2
N$52
  Bottom 0.406: Q11.1 D33.C
N$53
  Bottom 0.406: D34.C D33.A 73.66,90.17 D35.C
N$54
  Bottom 0.406: D34.A R23.1 95.25,87.63 Q13.2
N$55
  Bottom 0.406: D36.C 95.25,82.55 97.79,80.01 Q13.3 104.14,80.01 110.49,86.36 116.84,86.36 U$2.AR2
N$56
  Bottom 0.406: D59.A R37.1 D58.A
N$57
  Bottom 0.406: R39.1 C8.1 | C8.1 Q21.2 | C8.1 D59.C
N$58
  Bottom 0.406: D38.C D39.C Q14.2 63.5,71.12 64.77,69.85 R26.2 D37.C
N$59
  Bottom 0.406: R27.2 Q14.3
N$60
  Bottom 0.406: D41.A R27.1 D40.A
N$61
  Bottom 0.406: C6.1 Q15.2 | R29.1 C6.1 | C6.1 D41.C
N$62  (via drill 0.81)
  Top 0.406: v40.64,67.31 v50.8,67.31
  Bottom 0.406: Q15.3 C6.2 25.4,76.2 39.37,76.2 40.64,74.93 v40.64,67.31 | v50.8,67.31 R30.1
N$63
  Bottom 0.406: U$2.AV2 117.23,74.05 116.84,73.66 105.41,73.66 105.41,67.31 104.14,66.04 96.52,66.04 R30.2
N$64
  Bottom 0.406: Q14.1 D42.C
N$65
  Bottom 0.406: D44.C 73.66,77.47 D42.A D43.C
N$66
  Bottom 0.406: D43.A R28.1 93.98,74.93 Q16.2
N$67
  Bottom 0.406: U$2.AU2 117.2,77.11 116.84,77.47 106.68,77.47 104.14,74.93 104.14,68.58 102.87,67.31 Q16.3 97.79,67.31 95.25,69.85 D45.C
N$68
  Bottom 0.406: D47.C D48.C Q17.2 63.5,58.42 64.77,57.15 R31.2 D46.C
N$69
  Bottom 0.406: R32.2 Q17.3
N$70
  Bottom 0.406: D50.A R32.1 D49.A
N$71
  Bottom 0.406: C7.1 D50.C | R34.1 C7.1 | C7.1 Q18.2
N$72  (via drill 0.81)
  Top 0.406: v40.64,54.61 v50.8,54.61
  Bottom 0.406: Q18.3 C7.2 25.4,63.5 39.37,63.5 40.64,62.23 v40.64,54.61 | v50.8,54.61 R35.1
N$73
  Bottom 0.406: R35.2 96.52,53.34 100.33,53.34 111.76,41.91 116.84,41.91 U$2.BF2
N$74
  Bottom 0.406: Q17.1 D51.C
N$75
  Bottom 0.406: D52.C D51.A 73.66,64.77 D53.C
N$76
  Bottom 0.406: D52.A R33.1 95.25,62.23 Q19.2
N$77
  Bottom 0.406: D54.C 95.25,57.15 97.79,54.61 Q19.3 111.51,45.72 116.84,45.72 U$2.BE2
N$78  (via drill 0.81)
  Top 0.406: v40.64,41.91 v50.8,41.91
  Bottom 0.406: Q21.3 C8.2 25.4,50.8 39.37,50.8 40.64,49.53 v40.64,41.91 | v50.8,41.91 R40.1
N$79
  Bottom 0.406: R40.2 96.52,40.64 101.6,40.64 109.22,33.02 116.84,33.02 U$2.BK2
N$80
  Bottom 0.406: Q20.1 D60.C
N$81
  Bottom 0.406: D62.C 73.66,52.07 D60.A D61.C
N$82
  Bottom 0.406: D61.A R38.1 95.25,49.53 Q22.2
N$83
  Bottom 0.406: D63.C 95.25,44.45 97.79,41.91 Q22.3 109.22,35.56 116.84,35.56 U$2.BJ2
N$84
  Bottom 0.406: D64.C R41.2 64.77,31.75 63.5,33.02 Q23.2 D66.C D65.C
N$85
  Bottom 0.406: R42.2 Q23.3
N$86
  Bottom 0.406: D68.A R42.1 D67.A
N$87
  Bottom 0.406: C9.1 D68.C | C9.1 Q24.2 | R44.1 C9.1
N$88  (via drill 0.81)
  Top 0.406: v40.64,29.21 v50.8,29.21
  Bottom 0.406: Q24.3 C9.2 25.4,38.1 39.37,38.1 40.64,36.83 v40.64,29.21 | v50.8,29.21 R45.1
N$89
  Bottom 0.406: U$2.BN2 116.84,22.86 101.6,22.86 R45.2
N$90
  Bottom 0.406: Q23.1 D69.C
N$91
  Bottom 0.406: D71.C 73.66,39.37 D69.A D70.C
N$92
  Bottom 0.406: D70.A R43.1 95.25,36.83 Q25.2
N$93
  Bottom 0.406: U$2.BM2 116.84,26.67 105.41,26.67 Q25.3 97.79,29.21 95.25,31.75 D72.C
N$96
  Bottom 0.406: U$2.AL2 116.84,99.06 109.22,99.06 102.87,93.98 99.06,93.98 95.25,97.79 D19.A
N$97
  Bottom 0.406: D28.A 95.25,85.09 99.06,81.28 101.6,81.28 110.49,90.17 116.84,90.17 U$2.AP2
N$98
  Bottom 0.406: D37.A 93.98,72.39 97.79,68.58 101.6,68.58 102.87,69.85 102.87,74.93 107.95,80.01 116.84,80.01 U$2.AT2
N$99
  Bottom 0.406: D46.A 95.25,59.69 99.06,55.88 104.14,55.88 111.76,48.26 116.84,48.26 U$2.BD2
N$100
  Bottom 0.406: D55.A 95.25,46.99 99.06,43.18 105.41,43.18 109.22,39.37 116.84,39.37 U$2.BH2
N$101
  Bottom 0.406: U$2.BL2 116.84,29.21 107.95,29.21 106.68,30.48 99.06,30.48 95.25,34.29 D64.A

### Text on the board
Bottom: DECODING DRIVER W108C
200bmp: C:/Users/Vince/Documents/websvn/trunk/Eagle/projects/DEC/Wxxx/W103/W103Cbackfb.bmp